# EAGLE design roller-shutter-controller (EAGLE 6.2)
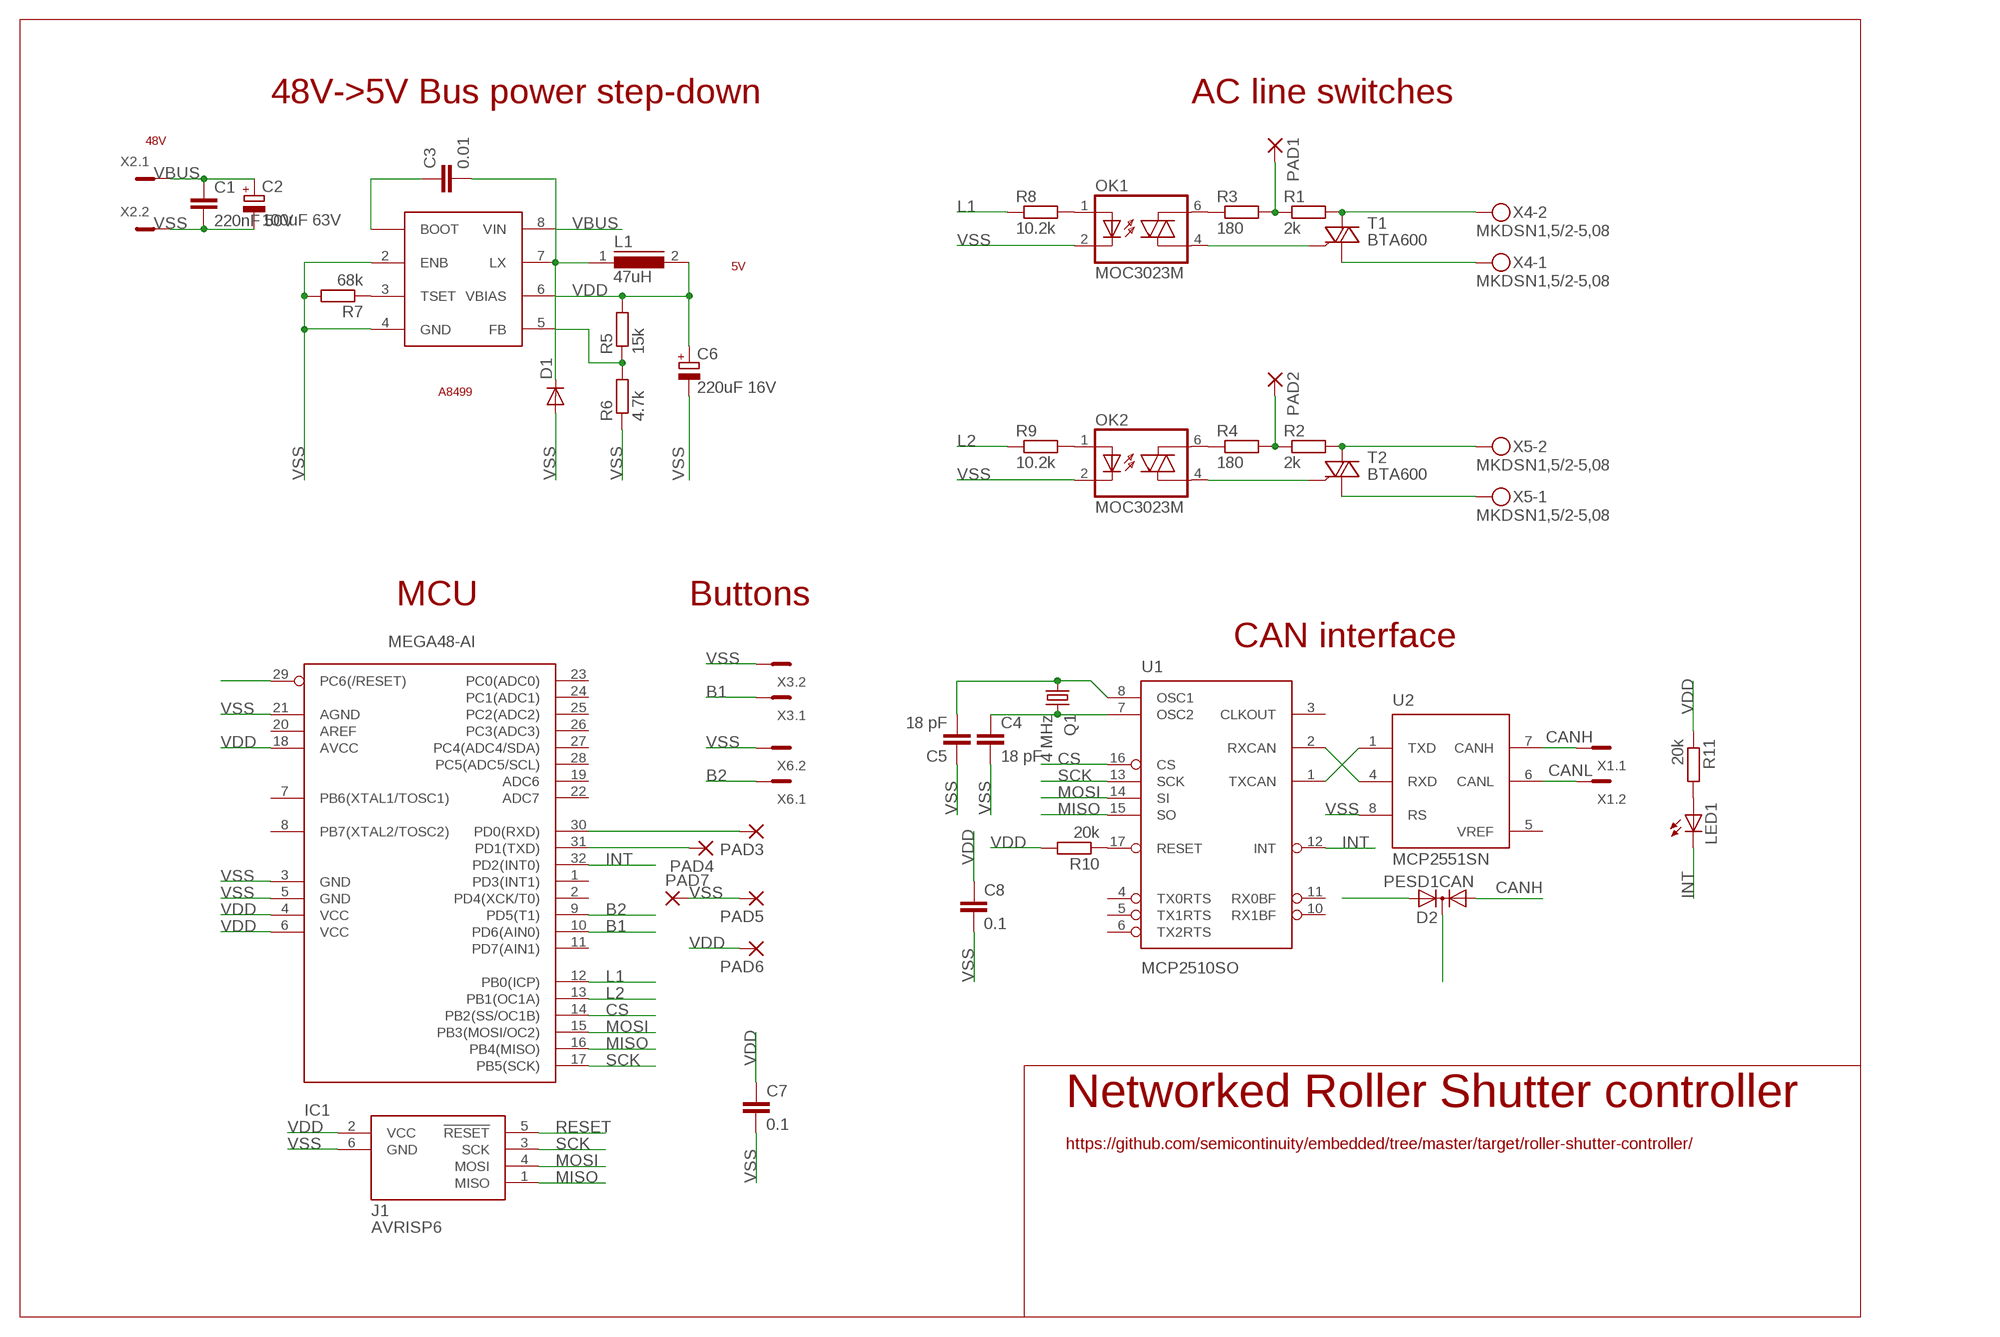
[diagram p0: schematic, sheet 1]

## Parts
C1  220nF 50V  C-EUC0805  [C0805]
C2  100uF 63V  CPOL-EU153CLV-1010  [153CLV-1010]
C3  0.01  C-EUC0805  [C0805]
C4  18 pF  C-EUC0805  [C0805]
C5  18 pF  C-EUC0805  [C0805]
C6  220uF 16V  CPOL-EU153CLV-0605  [153CLV-0605]
C7  0.1  C-EUC0805  [C0805]
C8  0.1  C-EUC0805  [C0805]
D1  DIODE-SMB  [SMB]
D2  PESD1CAN  DIODEA2KSOT323  [SOT323]
IC1  MEGA48-AI  MEGA8-AI  [TQFP32-08]
J1  AVRISP6  [CON6P2R]
L1  47uH  DR127  [DR127]
LED1  LEDCHIP-LED0805  [CHIP-LED0805]
OK1  MOC3023M  [DIL06]
OK2  MOC3023M  [DIL06]
PAD1  1,6/0,8  [1,6/0,8]
PAD2  1,6/0,8  [1,6/0,8]
PAD3  1,6/0,8  [1,6/0,8]
PAD4  1,6/0,8  [1,6/0,8]
PAD5  1,6/0,8  [1,6/0,8]
PAD6  1,6/0,8  [1,6/0,8]
PAD7  1,6/0,8  [1,6/0,8]
Q1  4 MHz  CRYSTALHC49S  [HC49/S]
R1  2k  R-EU_M0805  [M0805]
R2  2k  R-EU_M0805  [M0805]
R3  180  R-EU_M0805  [M0805]
R4  180  R-EU_M0805  [M0805]
R5  15k  R-EU_R0805  [R0805]
R6  4.7k  R-EU_R0805  [R0805]
R7  68k  R-EU_R0805  [R0805]
R8  10.2k  R-EU_R0805  [R0805]
R9  10.2k  R-EU_R0805  [R0805]
R10  20k  R-EU_R0805  [R0805]
R11  20k  R-EU_R0805  [R0805]
T1  BTA600  TIC225S  [TO220DS]
T2  BTA600  TIC225S  [TO220DS]
U1  MCP2510SO  [SO-18W]
U2  MCP2551SN  [SO-08]
U$1  A8499  A8499SLJT  [SO08]
X1  MCV2  [MCV2]
X2  MCV2  [MCV2]
X3  MCV2  [MCV2]
X4  MKDSN1,5/2-5,08  [MKDSN1,5/2-5,08]
X5  MKDSN1,5/2-5,08  [MKDSN1,5/2-5,08]
X6  MCV2  [MCV2]

## Nets
B1: IC1.10(PD6(AIN0)) X3.1
B2: IC1.9(PD5(T1)) X6.1
BOOT: C3.1 U$1.1(BOOT)
CANH: D2.1(A1) U2.7(CANH) X1.1
CANL: D2.2(A2) U2.6(CANL) X1.2
CS: IC1.14(PB2(SS/OC1B)) U1.16(CS)
INT: IC1.32(PD2(INT0)) LED1.C U1.12(INT)
L1: IC1.12(PB0(ICP)) R8.1
L2: IC1.13(PB1(OC1A)) R9.1
LX: C3.2 D1.C L1.1 U$1.7(LX)
MISO: IC1.16(PB4(MISO)) J1.1(MISO) U1.15(SO)
MOSI: IC1.15(PB3(MOSI/OC2)) J1.4(MOSI) U1.14(SI)
N$1: R1.2 T1.A2 X4.2
N$2: T1.A1 X4.1
N$3: R2.2 T2.A2 X5.2
N$4: OK1.6(A2) R3.1
N$5: PAD1.1(P) R1.1 R3.2
N$6: OK1.4(A1) T1.G
N$7: OK2.6(A2) R4.1
N$8: OK2.4(A1) T2.G
N$9: PAD2.1(P) R2.1 R4.2
N$10: T2.A1 X5.1
N$11: C4.1 Q1.2 U1.7(OSC2)
N$12: C5.2 Q1.1 U1.8(OSC1)
N$13: IC1.30(PD0(RXD)) PAD3.1(P)
N$14: R5.1 R6.2 U$1.5(FB)
N$15: R7.1 U$1.3(TSET)
N$16: IC1.31(PD1(TXD)) PAD4.1(P)
N$17: OK1.1(A) R8.2
N$18: OK2.1(A) R9.2
N$19: R10.1 U1.17(RESET)
N$20: LED1.A R11.2
RESET: IC1.29(PC6(/RESET)) J1.5(!RESET)
RXD: U1.2(RXCAN) U2.4(RXD)
SCK: IC1.17(PB5(SCK)) J1.3(SCK) U1.13(SCK)
TXD: U1.1(TXCAN) U2.1(TXD)
VBUS: C1.1 C2.+ U$1.8(VIN) X2.1
VDD: C6.+ C7.1 C8.1 IC1.4(VCC) IC1.6(VCC) IC1.18(AVCC) J1.2(VCC) L1.2 PAD6.1(P) R5.2 R10.2 R11.1 U$1.6(VBIAS)
VSS: C1.2 C2.- C4.2 C5.1 C6.- C7.2 C8.2 D1.A D2.3(C) IC1.3(GND) IC1.5(GND) IC1.21(AGND) J1.6(GND) OK1.2(C) OK2.2(C) PAD5.1(P) PAD7.1(P) R6.1 R7.2 U2.8(RS) U$1.2(ENB) U$1.4(GND) X2.2 X3.2 X6.2
Unconnected: IC1.1(PD3(INT1)) IC1.2(PD4(XCK/T0)) IC1.7(PB6(XTAL1/TOSC1)) IC1.8(PB7(XTAL2/TOSC2)) IC1.11(PD7(AIN1)) IC1.19(ADC6) IC1.20(AREF) IC1.22(ADC7) IC1.23(PC0(ADC0)) IC1.24(PC1(ADC1)) IC1.25(PC2(ADC2)) IC1.26(PC3(ADC3)) IC1.27(PC4(ADC4/SDA)) IC1.28(PC5(ADC5/SCL)) U1.3(CLKOUT) U1.4(TX0RTS) U1.5(TX1RTS) U1.6(TX2RTS) U1.10(RX1BF) U1.11(RX0BF)

## Notes on the sheet
- 48V->5V Bus power step-down | AC line switches
- 48V
- 5V
- A8499
- MCU | Buttons
- CAN interface
- Networked Roller Shutter controller
- https://github.com/semicontinuity/embedded/tree/master/target/roller-shutter-controller/

## Power pins joined to a net without a drawn wire
VDD: U1.18(VDD) U2.3(VDD)
VREF: U2.5(VREF)
VSS: U1.9(VSS) U2.2(VSS)

## Library data of the parts
C1 C3-C5 C7 C8 = rcl:C-EU: CAPACITOR, European symbol
C2 C6 = rcl:CPOL-EU: POLARIZED CAPACITOR, European symbol
D1 = diode:DIODE-: DIODE
D2 = ads4:DIODEA2K: Diode with 2 Anodes and 1 Cathode
IC1 = my-atmel:MEGA8: MICROCONTROLLER 8 Kbytes FLASH 1 kbytes SRAM 512 bytes EEPROM USART 6-channel 10 bit ADC 2-channel 8 bit ADC
J1 = ads4:AVRISP6: 6-pin dual-row connector for Atmel AVRISP programmer interface
L1 = inductors:DR127: High Power Density, High Efficiency, Shielded Inductors Source: coiltronics_dr_series.pdf
LED1 = led:LED: LED OSRAM: - CHIPLED LG R971, LG N971, LY N971, LG Q971, LY Q971, LO R971, LY R971 LH N974, LH R974 LS Q976, LO Q976, LY Q976 LO Q996 - Hyper CHIPLED LW Q18S LB Q993, LB Q99A, LB R99A - SideLED LS A670, LO A670, LY A670, LG A670, LP A670 LB A673, LV A673, LT A673, LW A673 LH A674 LY A675 LS A676, LA A676, LO A676, LY A676, LW A676 LS A679, LY A679, LG A679 - Hyper Micro SIDELED® LS Y876, LA Y876, LO Y876, LY Y876 LT Y87S - SmartLED LW L88C, LW L88S LB L89C, LB L89S, LG L890 LS L89K, LO L89K, LY L89K LS L896, LA L896, LO L896, LY L896 - TOPLED LS T670, LO T670, LY T670, LG T670, LP T670 LSG T670, LSP T670, LSY T670, LOP T670, LYG T670 LG T671, LOG T671, LSG T671 LB T673, LV T673, LT T673, LW T673 LH T674 LS T676, LA T676, LO T676, LY T676, LB T676, LH T676, LSB T676, LW T676 LB T67C, LV T67C, LT T67C, LS T67K, LO T67K, LY T67K, LW E67C LS E67B, LA E67B, LO E67B, LY E67B, LB E67C, LV E67C, LT E67C LW T67C LS T679, LY T679, LG T679 LS T770, LO T770, LY T770, LG T770, LP T770 LB T773, LV T773, LT T773, LW T773 LH T774 LS E675, LA E675, LY E675, LS T675 LS T776, LA T776, LO T776, LY T776, LB T776 LHGB T686 LT T68C, LB T68C - Hyper Mini TOPLED® LB M676 - Mini TOPLED Santana® LG M470 LS M47K, LO M47K, LY M47K Source: http://www.osram.convergy.de LUXEON: - LUMILED® LXK2-PW12-R00, LXK2-PW12-S00, LXK2-PW14-U00, LXK2-PW14-V00 LXK2-PM12-R00, LXK2-PM12-S00, LXK2-PM14-U00 LXK2-PE12-Q00, LXK2-PE12-R00, LXK2-PE12-S00, LXK2-PE14-T00, LXK2-PE14-U00 LXK2-PB12-K00, LXK2-PB12-L00, LXK2-PB12-M00, LXK2-PB14-N00, LXK2-PB14-P00, LXK2-PB14-Q00 LXK2-PR12-L00, LXK2-PR12-M00, LXK2-PR14-Q00, LXK2-PR14-R00 LXK2-PD12-Q00, LXK2-PD12-R00, LXK2-PD12-S00 LXK2-PH12-R00, LXK2-PH12-S00 LXK2-PL12-P00, LXK2-PL12-Q00, LXK2-PL12-R00 Source: www.luxeon.com KINGBRIGHT: KA-3528ASYC Source: www.kingbright.com
OK1 OK2 = optocoupler:MOC30*M: RANDOM-PHASE OPTOISOLATORS TRIAC DRIVER OUTPUT Source: http://www.fairchildsemi.com MOC3020-M.pdf
PAD1-PAD7 = wirepad:1,6/0,8: THROUGH-HOLE PAD
Q1 = crystal:CRYSTAL: CRYSTAL; OC_FARNELL: 1667008; OC_NEWARK: unknown
R1-R11 = rcl:R-EU_: RESISTOR, European symbol
T1 T2 = cls:TIC225S: TRIAC
U1 = my-microchip-can:MCP2510
U2 = my-microchip-can:MCP2551: High Speed CAN tranceiver
U$1 = my-allegro:A8499SLJT: A8499SLJT Allegro Microsystems Step-Down regulator, 8V-50V, 1.5A, SO8
X1-X3 X6 = con-phoenix-381_l:MCV2: Mini-Combicon 3.81mm vertikal 2polig MCV 1,5/2-G-3,81 Artikel-Nr. 1803426
X4 X5 = con-phoenix-508:MKDSN1,5/2-5,08: MKDSN 1,5/ 2-5,08 Printklemme Nennstrom: 13,5 A Nennspannung: 250 V Rastermaß: 5,08 mm Polzahl: 2 Anschlussart: Schraubanschluss Montage: Löten Anschlussrichtung Leiter/Platine: 0 ° Artikelnummer: 1729128 Source: http://eshop.phoenixcontact.com .. 1729128.pdf; MPN: MKDSN 1,5/2-5.08; OC_FARNELL: 1792903; OC_NEWARK: 30M2397

## Board
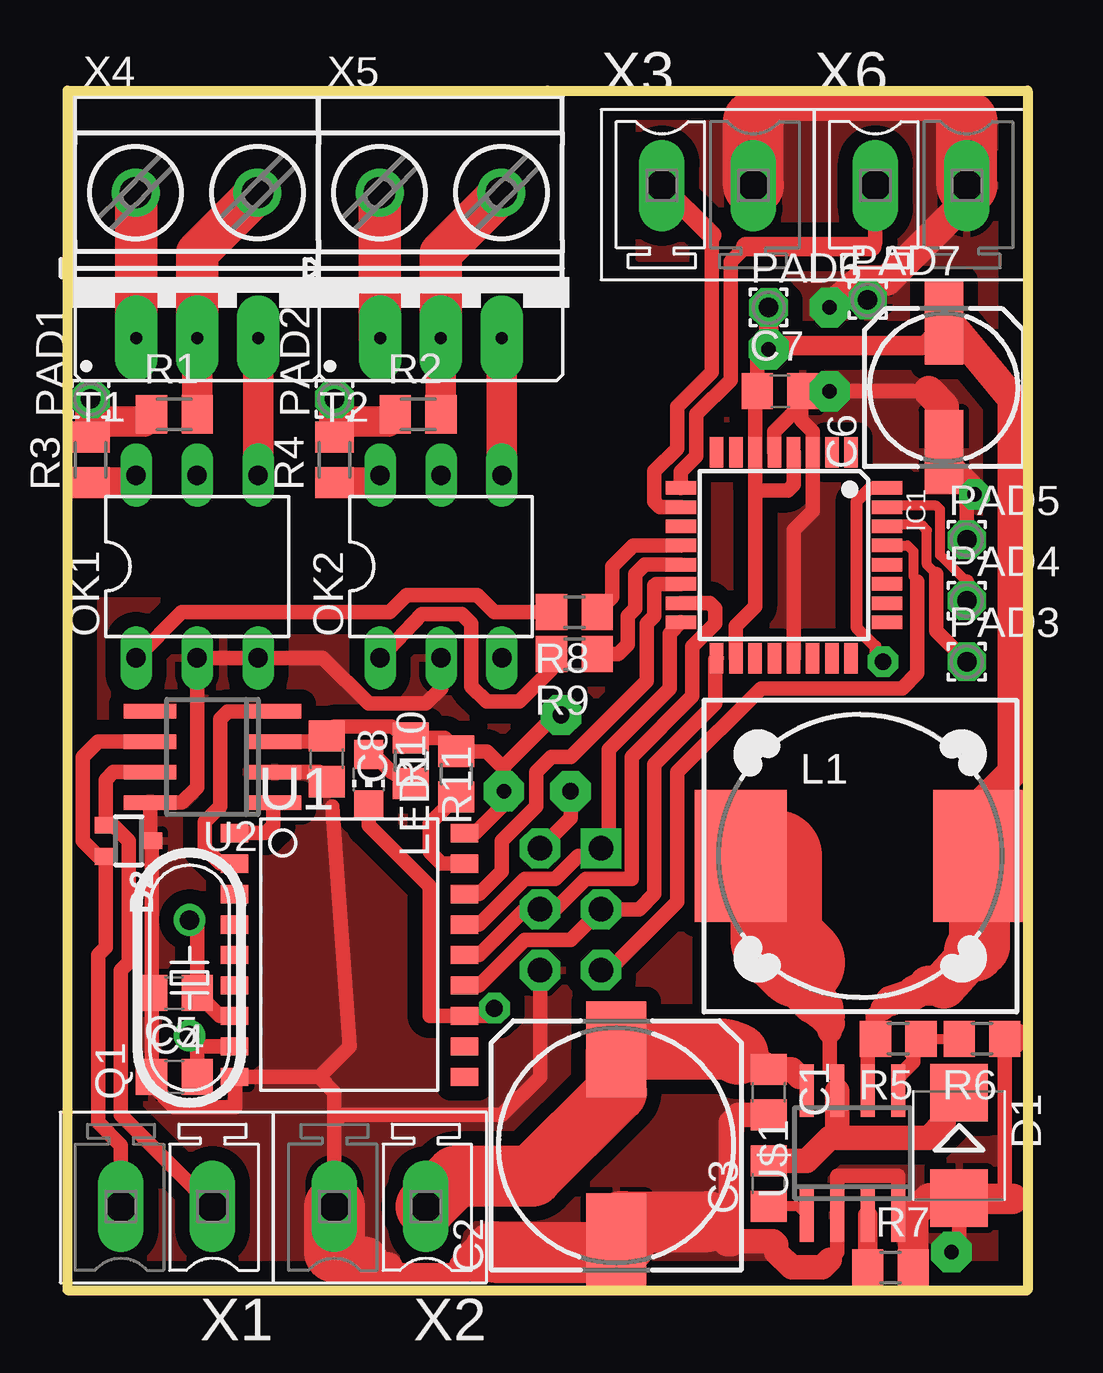
[diagram p1: board, top side]
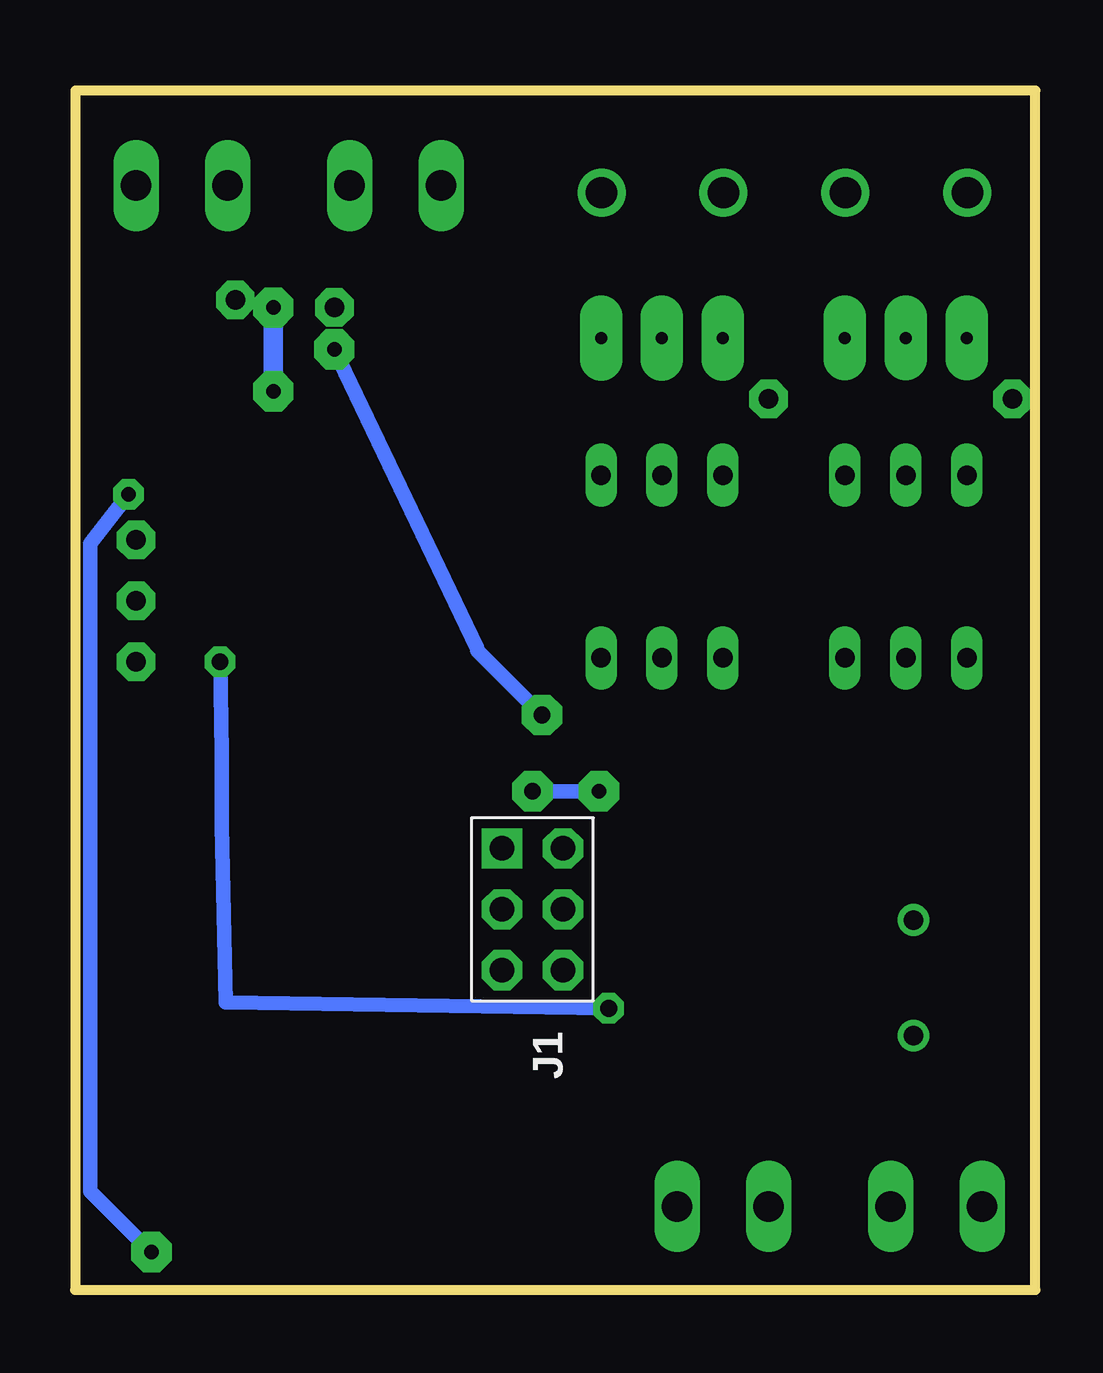
[diagram p2: board, bottom side, seen from below]

Size 40.01 x 50 mm. Coordinates in mm from the lower left corner, seen from the top.
Outline: 20,50 0,50 0,0 40.01,0
Outline: 20,50 40,50 40,0
Outline: 20,50 20,50
Copper layers (1*16): Top 0.035mm / dielectric 1.5mm / Bottom 0.035mm
Design rules: minimum track width 10mil, minimum drill 24mil, track to track 8mil, track to pad 8mil, pad to pad 8mil, via to via 8mil, smd to smd 8mil, copper to edge 40mil, drill to drill 8mil, minimum pad ring 10mil, minimum via ring 8mil, stop-mask expansion 4mil, vias tented up to drill 0mil, thermal gap 10mil

### Footprints (pad centres in the part's own frame; a part is rotated, then mirrored left to right if it is on the bottom)
C0805 = smd 1.3 x 1.5: 1 -0.95,0; 2 0.95,0
153CLV-1010 = smd 4 x 2.5: + 4,0; - -4,0
153CLV-0605 = smd 3.5 x 1.6: + 2.7,0; - -2.7,0
SMB = smd 2.4 x 2.4: A 2.2,0; C -2.2,0
SOT323 = smd 0.7 x 0.9: 1 -0.65,-0.95; 2 0.65,-0.95; 3 0,0.95
TQFP32-08 = smd 1.27 x 0.559: 1 -4.293,2.8; 2 -4.293,2; 3 -4.293,1.2; 4 -4.293,0.4; 5 -4.293,-0.4; 6 -4.293,-1.2; 7 -4.293,-2; 8 -4.293,-2.8; 17 4.293,-2.8; 18 4.293,-2; 19 4.293,-1.2; 20 4.293,-0.4; 21 4.293,0.4; 22 4.293,1.2; 23 4.293,2; 24 4.293,2.8 | smd 0.559 x 1.27: 9 -2.8,-4.293; 10 -2,-4.293; 11 -1.2,-4.293; 12 -0.4,-4.293; 13 0.4,-4.293; 14 1.2,-4.293; 15 2,-4.293; 16 2.8,-4.293; 25 2.8,4.293; 26 2,4.293; 27 1.2,4.293; 28 0.4,4.293; 29 -0.4,4.293; 30 -1.2,4.293; 31 -2,4.293; 32 -2.8,4.293
CON6P2R = drill 1.016 pad 1.676 square: 1 -2.54,-1.27 | drill 1.016 pad 1.676 octagon: 2 -2.54,1.27; 3 0,-1.27; 4 0,1.27; 5 2.54,-1.27; 6 2.54,1.27
DR127 = smd 3.85 x 5.5: 1 -4.975,0; 2 4.975,0
CHIP-LED0805 = smd 1.2 x 1.2: A 0,-1.05; C 0,1.05
DIL06 = drill 0.813 long: 1 -2.54,-3.81; 2 0,-3.81; 3 2.54,-3.81; 4 2.54,3.81; 5 0,3.81; 6 -2.54,3.81
1,6/0,8 = drill 0.813 pad 1.6 octagon: 1 0,0
HC49/S = drill 0.813: 1 -2.413,0; 2 2.413,0
M0805 = smd 1.3 x 1.6: 1 -0.95,0; 2 0.95,0
R0805 = smd 1.3 x 1.5: 1 -0.95,0; 2 0.95,0
TO220DS = drill 0.5 pad 1.778 long: A1 -2.54,-2.54; A2 0,-2.54; G 2.54,-2.54
SO-18W = smd 0.762 x 1.143: 1 -5.08,-4.788; 2 -3.81,-4.788; 3 -2.54,-4.788; 4 -1.27,-4.788; 5 0,-4.788; 6 1.27,-4.788; 7 2.54,-4.788; 8 3.81,-4.788; 9 5.08,-4.788; 10 5.08,4.788; 11 3.81,4.788; 12 2.54,4.788; 13 1.27,4.788; 14 0,4.788; 15 -1.27,4.788; 16 -2.54,4.788; 17 -3.81,4.788; 18 -5.08,4.788
SO-08 = smd 0.6 x 2.2: 1 -1.905,-2.6; 2 -0.635,-2.6; 3 0.635,-2.6; 4 1.905,-2.6; 5 1.905,2.6; 6 0.635,2.6; 7 -0.635,2.6; 8 -1.905,2.6
SO08 = smd 0.6 x 2.2: 1 -1.905,-2.6; 2 -0.635,-2.6; 3 0.635,-2.6; 4 1.905,-2.6; 5 1.905,2.6; 6 0.635,2.6; 7 -0.635,2.6; 8 -1.905,2.6
MCV2 = drill 1.27 pad 1.905 long: 1 -1.905,0; 2 1.905,0
MKDSN1,5/2-5,08 = drill 1.3 pad 2: 1 -2.561,0.025; 2 2.519,0.025

### Placement (x,y rotation side)
C1  29.21,8.26 270 top
C2  22.86,6.03 90 top
C3  29.21,4.45 90 top
C4  4.45,12.38 180 top
C5  4.45,8.89 0 top
C6  36.51,37.62 90 top
C7  29.69,37.47 0 top
C8  10.79,22.15 270 top
D1  37.15,6.03 270 top
D2  2.54,18.73 270 top
IC1  29.84,30.64 270 top
J1  20.95,15.88 270 bottom
L1  33.02,18.1 0 top
LED1  12.54,21.27 180 top
OK1  5.4,30.16 0 top
OK2  15.56,30.16 0 top
PAD1  0.95,37.15 90 top
PAD2  11.11,37.15 90 top
PAD3  37.47,26.19 0 top
PAD4  37.47,28.73 0 top
PAD5  37.47,31.27 0 top
PAD6  29.21,40.96 0 top
PAD7  33.34,41.27 0 top
Q1  5.08,13.02 90 top
R1  4.45,36.51 0 top
R2  14.61,36.51 0 top
R3  0.95,34.61 90 top
R4  11.11,34.61 90 top
R5  34.61,10.48 180 top
R6  38.1,10.48 180 top
R7  34.29,0.95 0 top
R8  21.11,28.26 180 top
R9  21.11,26.51 180 top
R10  16.19,21.51 90 top
R11  14.29,22.07 270 top
T1  5.4,42.23 0 top
T2  15.56,42.23 0 top
U1  11.75,13.97 270 top
U2  6.03,22.23 90 top
U$1  32.7,5.71 0 top
X1  4.13,3.49 180 top
X2  13.02,3.49 180 top
X3  26.67,46.04 0 top
X4  5.39,45.73 0 top
X5  15.56,45.72 0 top
X6  35.56,46.04 0 top

### Tracks (layer width: path | path; a pad name or v marks a point on that pad's centre or on a via)
B1
  Top 0.61: IC1.10 24.67,32.64 24.45,32.86 24.45,34.13 25.4,35.08 25.4,36.83 26.83,38.26 26.83,43.97
  Top 0.813: 26.83,43.97 X3.1
B2
  Top 0.61: IC1.9 25.55,34.12 26.19,34.77 26.19,36.51 27.62,37.94 27.62,42.86 28.26,43.5 | 33.5,43.5 33.66,43.66 X6.1
  Top 0.813: 28.26,43.5 33.5,43.5
BOOT
  Top 0.406: U$1.1 30.42,3.5 C3.1
CANH
  Top 0.61: 6.03,3.81 X1.1 2.22,7.3 2.22,13.34 2.54,13.65 2.54,18.73 1.91,19.37 1.59,19.37 | U2.7 1.91,21.59 1.59,21.27 1.59,19.37 | 1.59,19.37 D2.1
CANL
  Top 0.61: U2.6 1.27,22.86 0.64,22.23 0.64,18.73 1.28,18.08 D2.2 1.59,14.29 1.27,13.97 1.27,6.99 2.22,6.03 X1.2
CS
  Top 0.61: U1.16 17.14,16.51 18.1,17.46 18.1,18.73 19.53,20.16 19.53,21.59 20.16,22.23 20.95,22.23 24.13,25.4 24.13,27.78 24.45,28.1 24.45,29.37 24.52,29.44 IC1.14
INT  (via drill 0.7 pad 1.27)
  Top 0.508: IC1.32 33.44,33.44 32.86,32.86 32.86,27.62 33.66,26.83 33.66,26.51 v33.97,26.19
  Top 0.61: v17.78,11.75 17.46,11.43 U1.12 15.08,11.43 15.08,16.83 12.54,19.37 LED1.C
  Bottom 0.61: v17.78,11.75 33.73,11.99 33.89,19.37 33.89,22.38 v33.97,26.19
L1
  Top 0.61: R8.1 22.7,28.89 22.7,30.16 23.58,31.04 IC1.12
L2
  Top 0.61: IC1.13 24.05,30.24 23.65,29.84 23.65,28.42 23.34,28.1 23.34,26.91 22.94,26.51 R9.1
LX
  Top 0.406: 37.12,8.23 D1.C 37.76,8.23 37.78,8.26
  Top 0.61: U$1.7 32.07,8.89 31.75,9.21 31.75,10.79
  Top 1.016: 31.75,10.79 31.75,11.11 | 37.12,8.23 36.51,7.62 36.51,6.99 35.88,6.35 32.07,6.35 | 32.07,6.35 U$1.7 | C3.2 30.8,5.4 31.75,6.35 32.07,6.35
  Top 1.27: 31.75,11.11 31.43,11.43 31.75,11.43 31.43,11.75
  Top 1.778: 31.43,11.75 31.11,12.06
  Top 1.93: 31.11,12.06 30.8,12.38 30.8,12.7
  Top 2.184: 30.8,12.7 30.48,13.02 30.48,13.65
  Top 3.81: 30.48,13.65 29.53,14.61 29.53,18.1 L1.1
MISO
  Top 0.61: U1.15 17.14,15.24 19.05,17.14 20.32,17.14 21.27,18.1 22.23,18.1 J1.1 22.54,18.73 22.54,22.54 25.08,25.08 25.08,27.37 IC1.16
MOSI
  Top 0.61: U1.14 17.14,13.97 19.05,15.88 J1.4 20.32,15.88 21.59,17.14 23.5,17.14 23.5,22.23 26.04,24.77 26.04,26.83 26.99,27.78 26.99,28.42 26.77,28.64 IC1.15
N$1
  Top 1.27: R1.2 T1.A2
  Top 1.778: X4.2 5.4,43.24 T1.A2
N$2
  Top 1.778: X4.1 2.86,45.72 T1.A1
N$3
  Top 1.27: R2.2 T2.A2
  Top 1.778: X5.2 15.56,43.23 T2.A2
N$4
  Top 1.27: R3.1 2.54,33.66 arc90 OK1.6
N$5
  Top 1.27: R1.1 3.18,36.2 0.95,36.2 PAD1.1 R3.2
N$6
  Top 1.27: T1.G OK1.4
N$7
  Top 1.27: OK2.6 12.7,33.66 R4.1
N$8
  Top 1.27: OK2.4 T2.G
N$9
  Top 1.27: PAD2.1 11.11,36.2 | 11.11,36.2 R4.2 | R2.1 13.34,36.2 11.11,36.2
N$10
  Top 1.778: T2.A1 13,39.71 X5.1
N$11
  Top 0.61: U1.7 6.35,11.43 C4.1 5.39,15.12 Q1.2
N$12
  Top 0.61: U1.8 5.52,10.16 Q1.1 5.39,10.29 C5.2
N$13
  Top 0.406: 36.2,29.84 35.8,30.24 35.8,31.67 35.56,31.91 34.21,31.91 IC1.30
  Top 0.61: PAD3.1 36.2,27.46 36.2,29.84
N$14
  Top 0.406: R5.1 R6.2
  Top 0.61: R5.1 35.24,10.16 35.24,9.53 34.61,8.89 U$1.5
N$15
  Top 0.406: R7.1
  Top 0.813: U$1.3 R7.1
N$16
  Top 0.406: 37.47,29.53 36.35,30.64 36.35,32.54 36.2,32.7 34.2,32.7 IC1.31
  Top 0.61: PAD4.1 37.47,29.53
N$17
  Top 0.61: OK1.1 4.76,28.26 13.41,28.26 14.13,28.97 17.07,28.97 17.78,28.26 R8.2
N$18
  Top 0.61: OK2.1 14.76,28.18 16.43,28.18 16.83,27.78 16.83,25.16 17.46,24.53 18.81,24.53 20.16,25.88 R9.2
N$19
  Top 0.61: U1.17 15.56,17.78 15.08,18.26 15.08,19.45 R10.1
N$20
  Top 0.61: LED1.A 12.6,22.48 13.49,21.59 R11.2
RESET
  Top 0.406: IC1.29 35,31.04 35.24,30.8 35.24,29.77 35.4,29.53
  Top 0.61: J1.5 22.54,13.34 25.4,16.19 25.4,21.59 28.89,25.08 34.77,25.08 35.4,25.72 35.4,29.53
RXD
  Top 0.61: U1.2 6.35,17.78 5.71,18.41 5.71,19.53 6.35,20.16 6.35,23.81 6.67,24.13 U2.4
SCK
  Top 0.61: U1.13 17.14,12.7 19.05,14.61 20.95,14.61 J1.3 23.81,15.88 24.45,16.51 24.45,21.91 26.99,24.45 26.99,26.29 IC1.17
TXD
  Top 0.61: U1.1 8.26,19.05 8.57,19.37 8.57,20.26 U2.1
VBUS
  Top 0.61: U$1.8 30.8,8.57 30.48,8.89
  Top 1.016: 23.62,10.79 C2.+ | 30.48,8.89 30.16,9.21 C1.1
  Top 1.27: C1.1 27.94,9.84
  Top 2.54: 27.94,9.84 27.43,10.03 C2.+ 22.86,8.26 19.37,4.76 16.19,4.76 X2.1
VDD  (via drill 0.6 pad 1.68, 0.7 pad 1.68)
  Top 0.406: 33.34,10.47 R5.2 33.66,10.79 | 37.99,16.09 L1.2
  Top 0.61: 33.34,10.47 U$1.6 | 28.64,33.5 IC1.6 28.64,37.37 C7.1 28.74,38.74 v29.21,39.21 29.37,39.37 | 28.64,33.5 28.64,28.49 27.84,27.69 IC1.18 | 37.47,19.68 37.47,18.52 | 28.64,33.5 28.8,33.34 30,33.34 30.25,33.58 IC1.4 | C6.+ 35.56,39.37 | J1.2 20.95,19.68 v20.95,20.8 | v20.56,23.97 20.32,23.97 18.18,21.83 18.18,21.75 | U1.18 16.99,19.05 18.26,20.32 18.26,20.72 v18.18,20.8 | v18.18,20.8 18.18,21.75 | 18.02,20.64 v18.18,20.8 | U2.3 10.56,22.86 arc90 C8.1 arc-90 11.19,23.5 13.49,23.5 R11.1 15.72,23.02 R10.2 17.46,22.46 18.18,21.75
  Top 0.813: 33.66,10.79 33.66,11.43 33.97,11.75 | 35.56,39.37 29.37,39.37 | PAD6.1 v29.21,39.21
  Top 1.016: 33.97,11.75 34.29,12.06
  Top 1.27: 34.29,12.06 35.24,12.38 | 37.47,19.68 39.37,21.59 39.37,37.15 37.07,39.93 | 37.07,39.93 36.67,40.32 C6.+ | 36.91,39.93 37.07,39.93
  Top 1.422: 35.24,12.38 35.88,12.7
  Top 1.676: 35.88,12.7 36.51,12.7
  Top 1.93: 36.51,12.7 37.78,14.13
  Top 2.54: 37.78,14.13 37.99,14.34 L1.2 37.47,18.52
  Bottom 0.61: v29.21,39.21 23.26,26.75 23.26,26.67 v20.56,23.97 | v20.95,20.8 v18.18,20.8
VSS  (via drill 0.6 pad 1.27, 0.6 pad 1.68)
  Top 0.406: R7.2 | 34.61,3.17 U$1.4 | 22.23,2.03 C2.-
  Top 0.61: 31.75,1.27 32.07,1.59 U$1.2 32.07,4.76 34.61,4.76 U$1.4 35.18,3.12 35.24,3.17 | 10.48,8.89 11.75,10.16 11.03,20.16 | 10.48,8.89 U1.9 6.99,8.87 6.99,7.62 4.45,7.62 3.5,8.57 C5.1 C4.2 D2.3 3.43,18.99 U2.8 4.76,20.32 5.4,20.95 OK1.2 10.64,26.35 12.54,24.45 14.92,24.45 15.56,25.08 OK2.2 | X2.2 11.11,6.99 | 11.11,6.99 11.11,8.26 10.48,8.89 | J1.6 19.68,8.89 18.1,7.3 11.43,7.3 11.11,6.99 | IC1.21 30.25,31.67 31.05,32.47 IC1.3 31.05,35.79 30.56,36.27 30.56,36.91 | 39.37,10.48 39.69,10.79 | 39.37,3.81 39.05,4.13 R6.1 | v37.78,33.18 37.78,33.65 C6.- 37.47,33.97 PAD5.1 | v36.83,1.59 37.15,1.91 D1.A | IC1.5 29.45,35.8 30.56,36.91 | 30.56,36.91 30.64,36.99 C7.2 | 35.88,37.47 v31.75,37.47 | U2.2 10.48,21.59 10.48,21.51 arc90 C8.2
  Top 0.813: 13.34,0.95 13.55,0.73 16.2,0.73 16.42,0.95 16.51,0.95
  Top 1.016: C1.2 27.94,7.3 27.62,6.99 27.62,2.03 29.4,2.03 29.53,1.91 29.53,1.59 30.16,0.95 31.43,0.95 31.75,1.27
  Top 1.27: 26.67,2.86 27.5,2.03 27.62,2.03 | R7.2 35.24,3.17 35.9,3.83 D1.A 37.15,3.81 39.37,3.81 | 12.38,1.27 12.7,0.95 13.34,0.95 | 16.51,0.95 16.83,1.27 17.14,1.27 | R6.1 39.37,10.48 | C6.- 36.51,36.83 35.88,37.47 | 28.57,48.74 28.57,49.21 28.73,49.37 37.47,49.37 | 37.47,49.37 37.62,49.37 | 37.47,48.74 37.47,49.37 | X6.2 37.47,45.4 34.13,42.07 33.02,42.07 v31.75,40.96 | v31.75,37.47 C7.2
  Top 1.93: 11.11,1.59 11.43,1.27 12.38,1.27 | 17.14,1.27 17.46,1.59 17.78,1.59
  Top 2.54: 23.05,2.86 23.18,2.86 | 23.18,2.86 26.67,2.86 | X2.2 11.11,1.59 | 17.78,1.59 22.86,1.59 23.18,1.91 23.18,2.86 | X3.2 28.57,48.74 | X6.2 37.47,48.74
  Bottom 0.61: v37.78,33.18 39.37,31.11 39.37,4.13 v36.83,1.59
  Bottom 0.813: v31.75,37.47 v31.75,40.96
  pour Top (isolate 0.61): 0,0 40.01,0.16 40.01,6.83 25.88,11.27 25.88,25.88 40.01,25.88 40.01,49.85 23.81,49.85 23.81,43.02 26.51,43.02 26.51,36.51 24.13,34.13 24.13,31.11 21.91,28.89 13.49,28.89 13.34,28.73 0.95,28.73 0,27.78